# EAGLE design feather-power-switch-mk-2.0 (EAGLE 6.5.0)
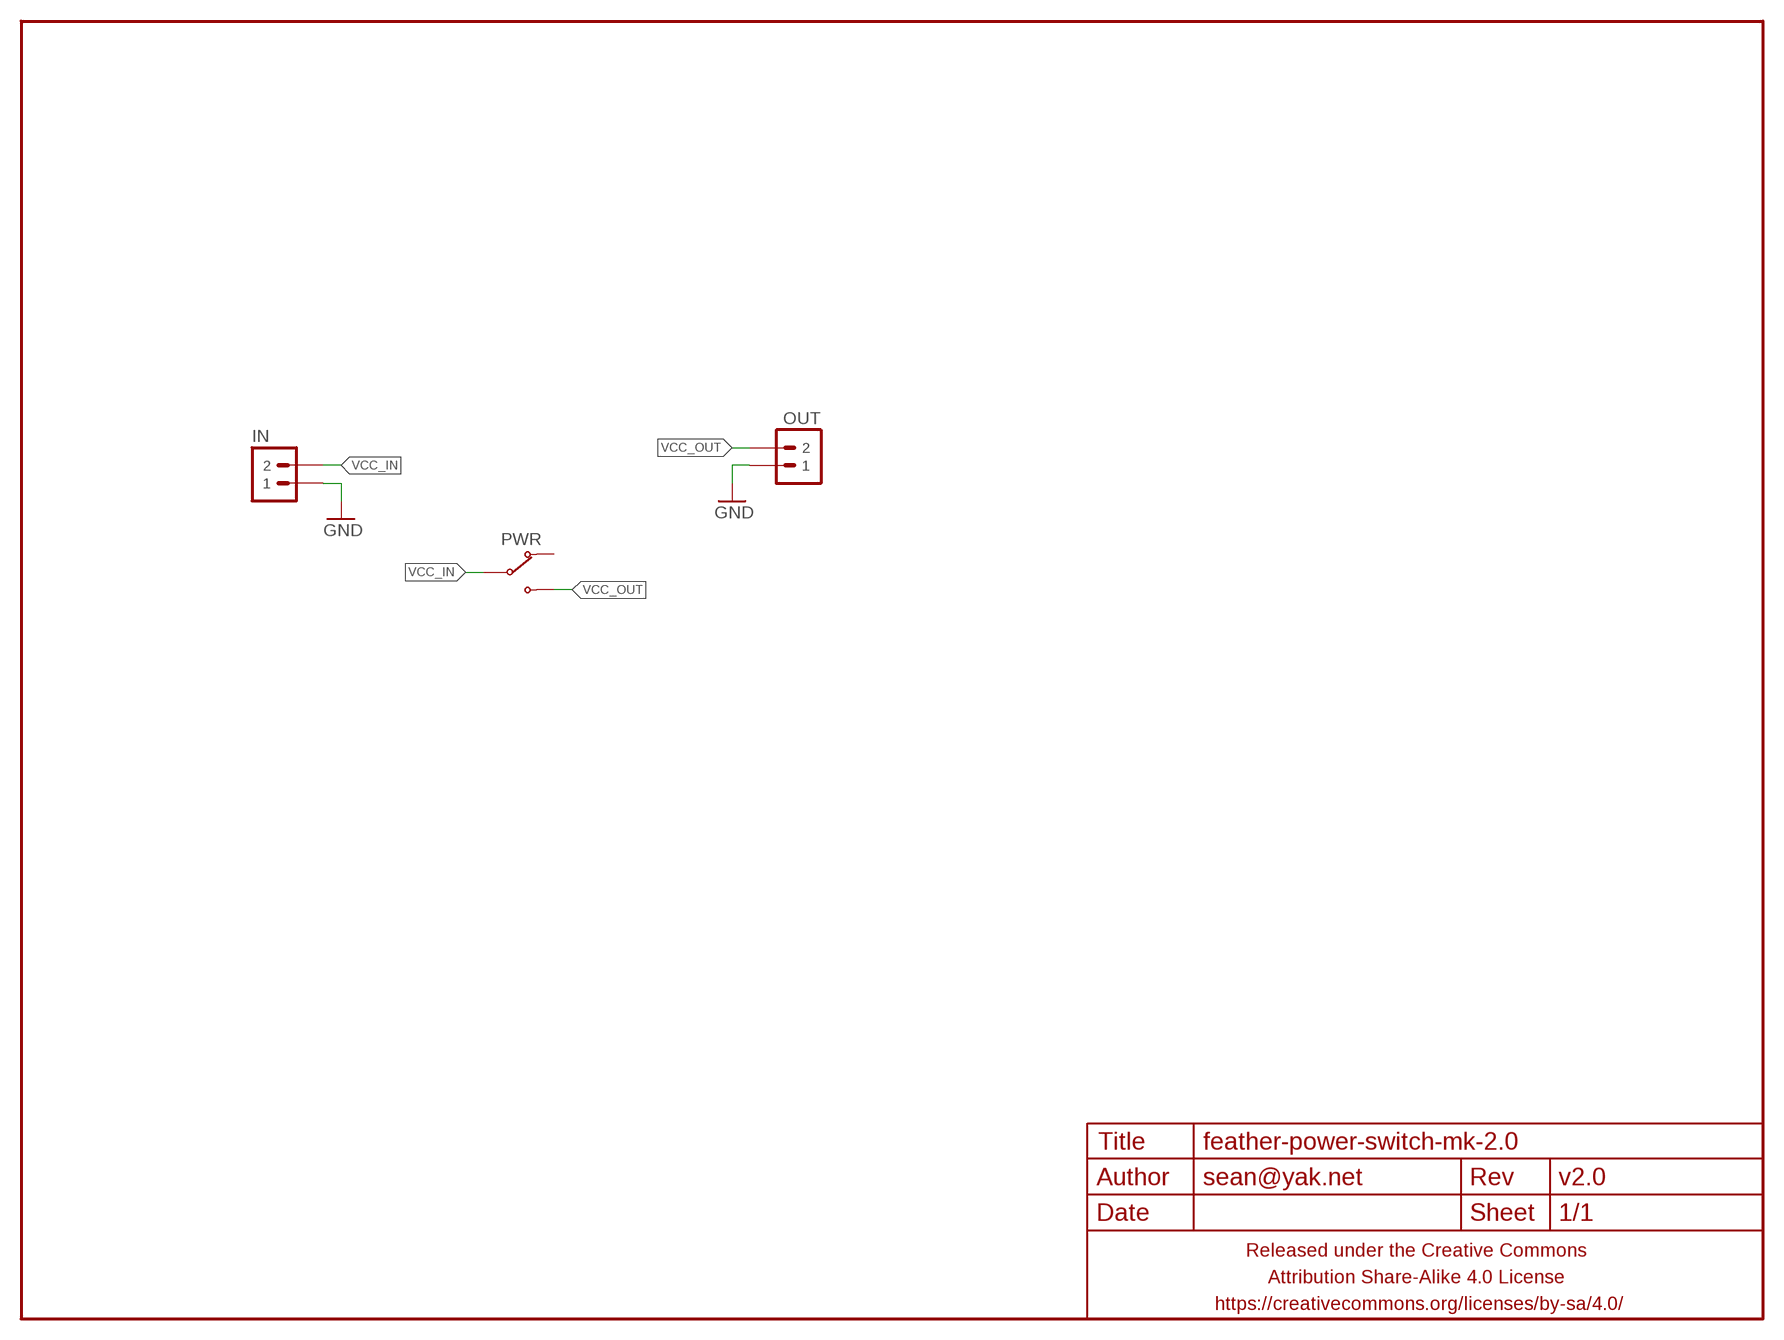
[diagram p0: schematic, sheet 1]

## Parts
FRAME1  FRAME-LETTERNO_PACKAGE  [DUMMY]
IN  M02PTH-CENTERED-R+  [1X02-CENTER-R+]
OUT  M02PTH-CENTERED-R+  [1X02-CENTER-R+]
PWR  SWITCH-SPDTSMD-RA  [SWITCH-SPDT-SMD-RA]

## Nets
GND: IN.1 OUT.1
VCC_IN: IN.2 PWR.2(COM)
VCC_OUT: OUT.2 PWR.1(NO)
Unconnected: PWR.3(NC)

## Library data of the parts
FRAME1 = A_butts:FRAME-LETTER: Schematic Frame Standard 8.5x11 US Letter frame; DESIGNER: sean@yak.net; VERSION: v2.0
IN OUT = A_butts:M02: Standard 2-pin 0.1" header. Use with - straight break away headers ( PRT-00116) - right angle break away headers (PRT-00553) - swiss pins (PRT-00743) - machine pins (PRT-00117) - female headers (PRT-00115) Molex polarized connector foot print use with: PRT-08233 with associated crimp pins and housings. 2.54_SCREWTERM for use with PRT-10571. 3.5mm Screw Terminal footprints for PRT-08084 5mm Screw Terminal footprints for use with PRT-08433
PWR = A_butts:SWITCH-SPDT

## Board
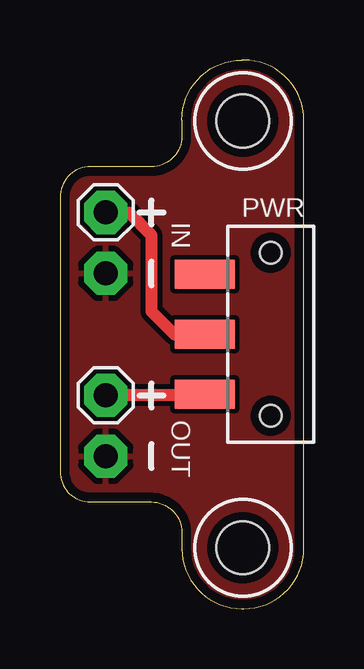
[diagram p1: board, top side]
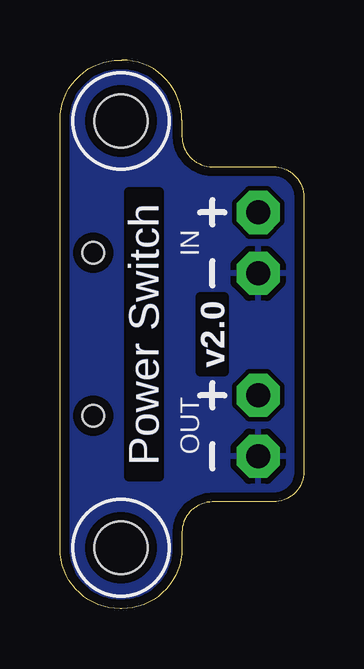
[diagram p2: board, bottom side, seen from below]

Size 10.16 x 22.86 mm. Coordinates in mm from the lower left corner, seen from the top.
Outline: 5.08,20.36 5.08,19.68 arc-90 3.81,18.41 1.27,18.41 arc90 0,17.14 0,5.71 arc90 1.27,4.45 3.81,4.45 arc-90 5.08,3.17 5.08,2.5 arc90 7.58,0 7.66,0 arc90 10.16,2.5 10.16,20.36 arc90 7.66,22.86 7.58,22.86 arc90 5.08,20.36
Copper layers (1*16): Top 0.0356mm / dielectric 1.5011mm / Bottom 0.0356mm
Design rules "LaenPCBOrder2": minimum track width 6mil, minimum drill 13mil, track to track 6mil, track to pad 6mil, pad to pad 6mil, via to via 6mil, smd to smd 6mil, copper to edge 15mil, drill to drill 6mil, minimum pad ring 7mil, minimum via ring 7mil, stop-mask expansion 3mil, vias tented up to drill 20mil, thermal gap 10mil
Holes 2.2 mm at 7.62,20.32 7.62,2.54

### Footprints (pad centres in the part's own frame; a part is rotated, then mirrored left to right if it is on the bottom)
1X02-CENTER-R+ = drill 1 pad 1.8 octagon: 1 -1.27,0; 2 1.27,0
SWITCH-SPDT-SMD-RA = smd 1.2 x 2.5: 1 -2.5,0; 2 0,0; 3 2.5,0 | hole 0.9: -3.4,-2.75; 3.4,-2.75

### Placement (x,y rotation side)
FRAME1  5.08,0 0 top
IN  1.91,15.24 90 top
OUT  1.91,7.62 90 top
PWR  6.03,11.43 90 top

### Tracks (layer width: path | path; a pad name or v marks a point on that pad's centre or on a via)
GND
  pour Bottom (isolate 0.2): 7.58,22.86 7.66,22.86 arc-90 10.16,20.36 10.16,2.5 arc-90 7.66,0 7.58,0 arc-90 5.08,2.5 5.08,3.17 arc90 3.81,4.45 1.27,4.45 arc-90 0,5.71 0,17.14 arc-90 1.27,18.41 3.81,18.41 arc90 5.08,19.68 5.08,20.36 arc-90
  pour Top (isolate 0.2): 7.58,22.86 7.66,22.86 arc-90 10.16,20.36 10.16,2.5 arc-90 7.66,0 7.58,0 arc-90 5.08,2.5 5.08,3.17 arc90 3.81,4.45 1.27,4.45 arc-90 0,5.71 0,17.14 arc-90 1.27,18.41 3.81,18.41 arc90 5.08,19.68 5.08,20.36 arc-90
VCC_IN
  Top 0.508: IN.2 2.86,16.51 3.81,15.56 3.81,12.38 4.76,11.43 PWR.2
VCC_OUT
  Top 0.508: PWR.1 5.99,8.89 OUT.2

### Text on the board
Bottom: Power Switch
bPlace: IN | Power Switch | OUT